# Altium schematic sheet light.SchDoc: Wprowadź Tytuł
size A4; CheckedBy: Wprowadź sprawdzającego; DrawnBy: Wprowadź autora; Organization: Koło Naukowe Robotyków; Address1: Nowowiejska 24; Address2: 00-001; Address3: Wraszawa; Address4: Polska; Revision: Numer; Nazwa Arkusza: Wpisz nazwę arkusza; ProjectName: Nazwa Projektu
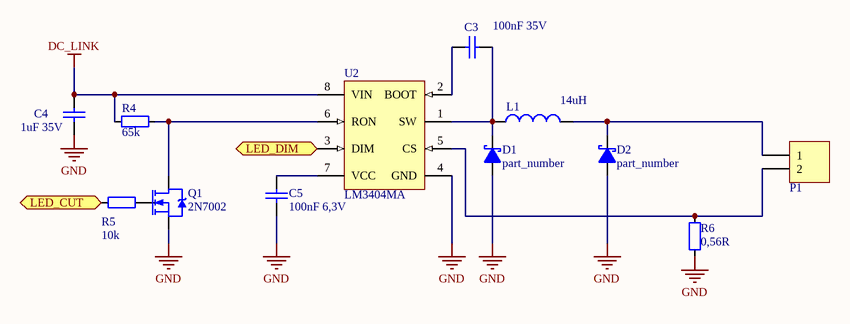
[diagram p0: light.SchDoc]

## Parts
C3  100nF 35V  [0603_CAP]
C4  1uF 35V  [0603_CAP]
C5  100nF 6,3V  [0603_CAP]
D1  part_number  [DO-219AB (SMF)]
D2  part_number  [DO-219AB (SMF)]
L1  14uH  [PA4341.223ANLT]
P1  HDR1X2  [HDR1X2]  (value not drawn)
Q1  2N7002  [Sot23]
R4  65k  [0603]
R5  10k  [0603]
R6  0,56R  [1206]
U2  LM3404MA  [M08A_N]

## Ports
LED_CUT, LED_DIM

## Nets
DC_LINK: C4.2 R4.1 U2.8(VIN)
GND: C4.1 C5.1 D1.1(A) D2.1(A) Q1.3(S) R6.1 U2.4(GND)
LED_CUT: R5.1 ; port LED_CUT
LED_DIM: U2.3(DIM) ; port LED_DIM
NetC3_1: C3.1 D1.2(K) L1.1 U2.1(SW)
NetC3_2: C3.2 U2.2(BOOT)
NetC5_2: C5.2 U2.7(VCC)
NetD2_2: D2.2(K) L1.2 P1.1
NetP1_2: P1.2 R6.2 U2.5(CS)
NetQ1_1: Q1.1(G) R5.2
NetQ1_2: Q1.2(D) R4.2 U2.6(RON)

## Notes on the sheet
- Narysował
- Sprawdził
- Projekt
- Date:
- Wersja
- Plik

## Library data of the parts
C3-C5 = Cap: Ceramic capacitor; Unit Price1: *; Unit Price2: *
  C3: Value: 100nF 35V
  C4: Value: 1uF 35V
  C5: Value: 100nF 6,3V
D1 D2 = Schottky: part_number: part_number
L1 = Inductor
P1 = HDR1X2: Header, 2-Pin; LatestRevisionDate: 17-Jul-2002; LatestRevisionNote: Re-released for DXP Platform.; Publisher: Altium Limited
R4-R6 = RES: Resistior
  R4: Value: 65k
  R5: Value: 10k
  R6: Value: 0,56R
U2 = LM3404MA: 1.0A Constant Current Buck Regulator for High Power LED Drivers, 8-pin Narrow SOIC; Manufacturer: National Semiconductor; PackageTopMarking: NSZXTT*L3404*MA; PowerWise: Y; CompType: MiscPower; DatasheetVersion: Feb-2010; PackageVersion: revM, May-2009; PackageReference: M08A; PackageDescription: SOIC Narrow, 4.9 x 3.9 x 1.45mm, 8 Lead, 1.27mm Pitch; PartNumber: LM3404MA; RoHS: N; PinCount: 8; High-Reliability: Y; Code_JEDEC: MS-012-AA; Code_IPC: SOIC127P600-8; ComponentLink1Description: Manufacturer URL; ComponentLink1URL: http://www.national.com/; ComponentLink2Description: LM3404 Datasheet; ComponentLink2URL: http://www.national.com/ds/LM/LM3404.pdf; ComponentLink3Description: LM3404 Web Page; ComponentLink3URL: http://www.national.com/pf/LM/LM3404.html; ComponentLink4Description: M08A Package Page; ComponentLink4URL: http://www.national.com/packaging/folders/m08a.html; HelpURL: C:\Users\micha\Documents\Studia\Inżynierka\Elektronika\Datasheets\LM3404.pdf